# EAGLE design working (EAGLE 6.4)
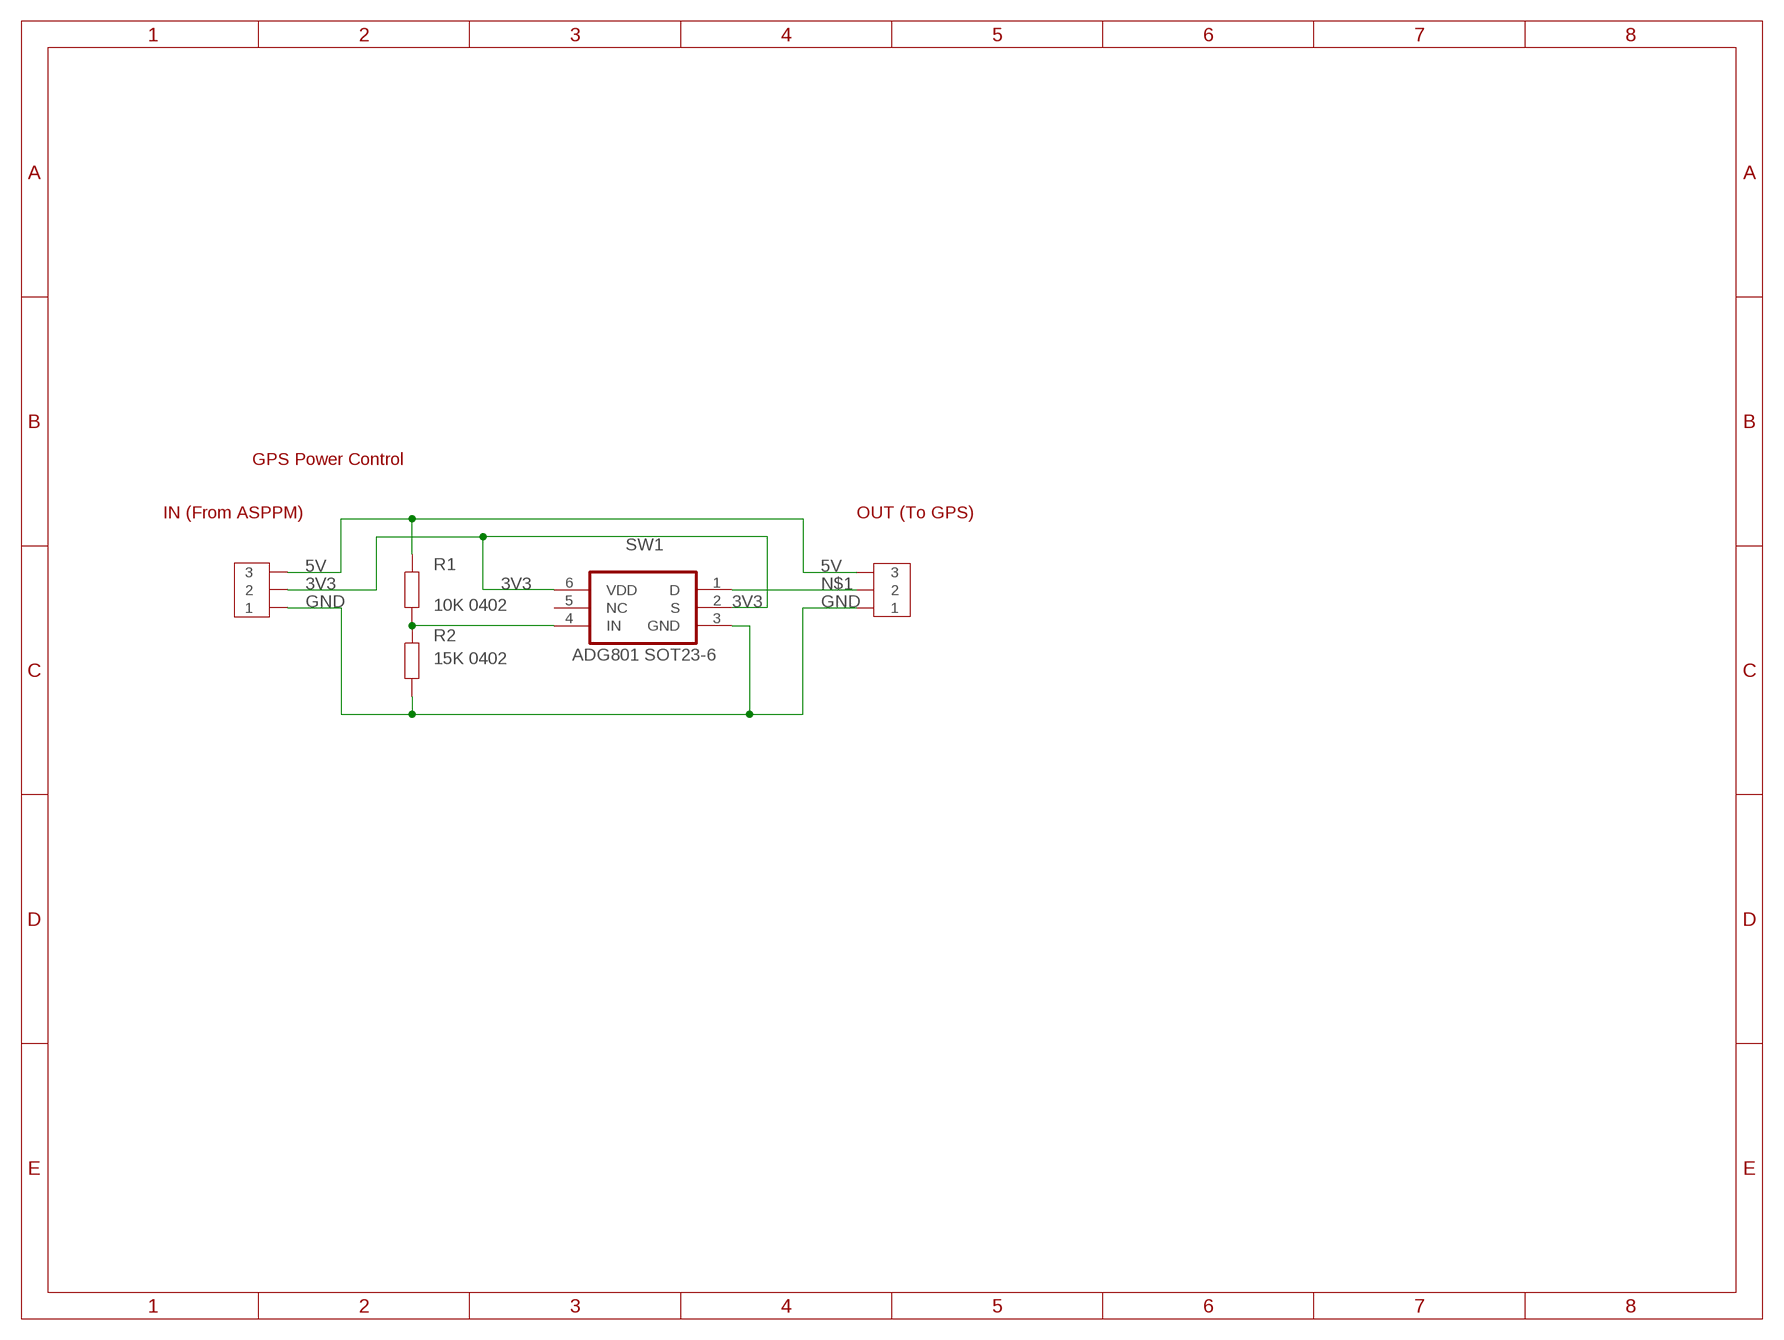
[diagram p0: schematic, sheet 1]

## Parts
JP1  3PIN_SMD  [1X3-2MM]
JP2  3PIN_SMD  [1X3-2MM]
R1  10K 0402  RESISTOR0402  [0402]
R2  15K 0402  RESISTOR0402  [0402]
SW1  ADG801 SOT23-6  ADG801SOT23-6  [SOT23-6]

## Nets
3V3: JP1.P$2 SW1.2(S) SW1.6(VDD)
5V: JP1.P$3 JP2.P$3 R1.2
GND: JP1.P$1 JP2.P$1 R2.1 SW1.3(GND)
N$1: JP2.P$2 SW1.1(D)
N$14: R1.1 R2.2 SW1.4(IN)
Unconnected: SW1.5(NC)

## Notes on the sheet
- GPS Power Control
- IN (From ASPPM) | OUT (To GPS)

## Library data of the parts
JP1 JP2 = NanoSatisfi:3PIN_SMD
R1 R2 = freetronics-jon:RESISTOR: Resistor Basic schematic elements and footprints for 0603, 1206, and PTH 1/10th watt (small) resistors.
SW1 = freetronics-jon:ADG801

## Board
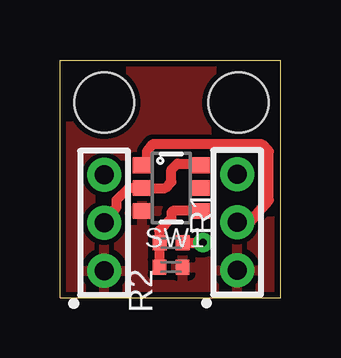
[diagram p1: board, top side]
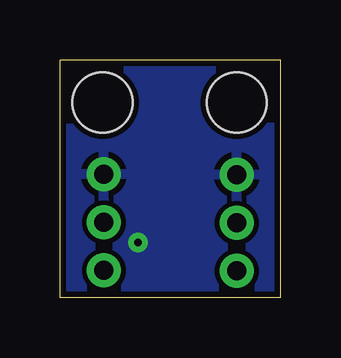
[diagram p2: board, bottom side, seen from below]

Size 9.21 x 9.91 mm. Coordinates in mm from the lower left corner, seen from the top.
Outline: 0,0 9.21,0 9.21,9.91 0,9.91 0,0
Copper layers [2:(1*(2*15)*16):15]: Top 0.035mm / dielectric 8.5mil / Route2 0.035mm / dielectric 39mil / Route15 0.035mm / dielectric 8.5mil / Bottom 0.035mm
Design rules "pentalogix": minimum track width 6mil, minimum drill 8mil, track to track 6mil, track to pad 6mil, pad to pad 6mil, via to via 6mil, smd to smd 4mil, copper to edge 10mil, drill to drill 8mil, minimum pad ring 12mil, minimum via ring 10mil, stop-mask expansion 4mil, vias tented up to drill 25mil, thermal gap 10mil
Holes 2.5 mm at 7.43,8.13 1.84,8.13

### Footprints (pad centres in the part's own frame; a part is rotated, then mirrored left to right if it is on the bottom)
1X3-2MM = drill 0.8: P$1 0,0; P$2 2,0; P$3 4,0
0402 = smd 0.571 x 0.62: 1 -0.48,0; 2 0.48,0
SOT23-6 = smd 0.65 x 0.8: 1 -0.95,-1.2; 2 0,-1.2; 3 0.95,-1.2; 4 0.95,1.2; 5 0,1.2; 6 -0.95,1.2

### Placement (x,y rotation side)
JP1  1.84,1.12 90 top
JP2  7.38,1.14 90 top
R1  4.64,2.29 0 top
R2  4.63,1.28 180 top
SW1  4.64,4.57 270 top

### Tracks (layer width: path | path; a pad name or v marks a point on that pad's centre or on a via)
3V3
  Top 0.406: JP1.P$2 2.35,3.78 2.35,4.06 2.86,4.57 SW1.2 4.38,4.57 4.64,4.83 4.64,5.33 4.89,5.59 5.77,5.59 SW1.6
5V  (via drill 0.3)
  Top 0.406: R1.2 5.93,2.29 | 5.93,2.29 | 5.93,2.29 5.95,2.29 v5.96,2.3
  pour Bottom (isolate 0.203): -2.03,11.43 11.43,11.43 11.43,-1.52 -2.03,-1.52
GND
  Top 0.406: R2.1
  pour Top (isolate 0.203): -1.27,10.67 10.67,10.67 10.67,-0.76 -1.27,-0.76
N$1
  Top 0.406: JP2.P$2 7.92,3.14 8.7,4.06 8.7,6.1 8.43,6.39 3.85,6.39 3.62,6.1 3.62,5.71 SW1.1
N$14
  Top 0.406: SW1.4 4.7,3.62 4.64,3.56 4.64,3.3 4.13,2.79 4.13,2.31 R1.1 4.15,2.28 R2.2